# Altium schematic sheet Sheet2.SchDoc: Arduino UNO REV3 Compatible
size A4; Organization: STARLING Electronics; Address2: Belo Horizonte, MG; Address3: Brasil; DocumentNumber: 00.00.01; Revision: 00; SheetNumber: 3; SheetTotal: 3
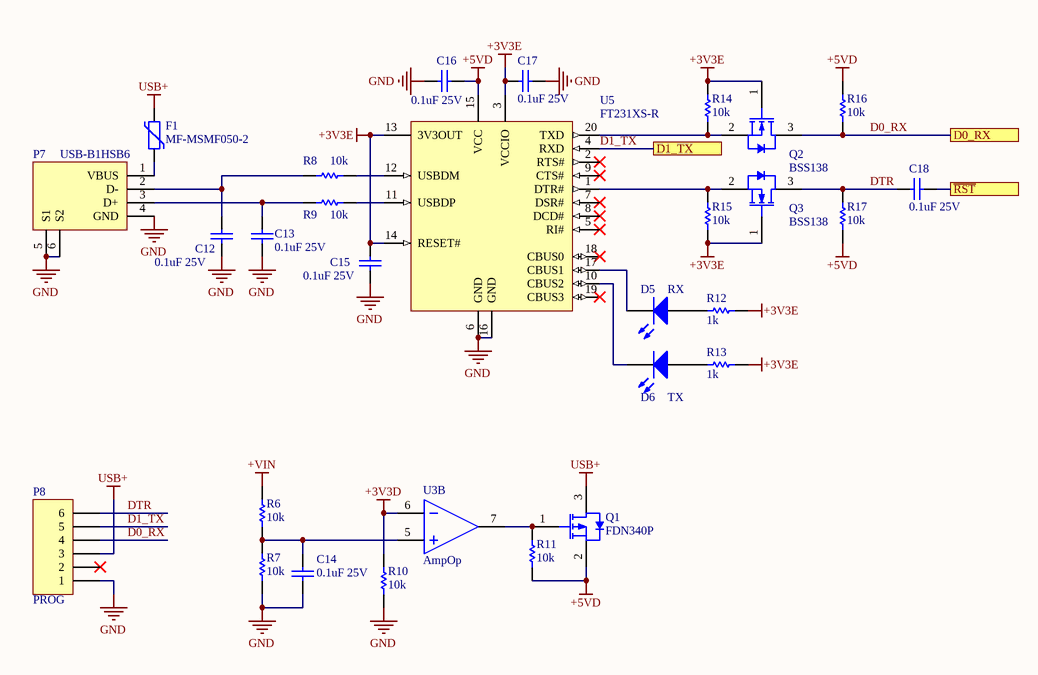
[diagram p0: Sheet2.SchDoc]

## Parts
C12  0.1uF 25V  [C1608[0603]]
C13  0.1uF 25V  [C1608[0603]]
C14  0.1uF 25V  [C1608[0603]]
C15  0.1uF 25V  [C1608[0603]]
C16  0.1uF 25V  [C1608[0603]]
C17  0.1uF 25V  [C1608[0603]]
C18  0.1uF 25V  [C1608[0603]]
D5  RX  [LED-0603-R]
D6  TX  [LED-0603-R]
F1  MF-MSMF050-2  [MF-MSMF050]
P7  USB-B1HSB6  [USB_TYPE_B]
P8  PROG  [HDR1X6m]
Q1  FDN340P  [SOT23]
Q2  BSS138  [SOT23]
Q3  BSS138  [SOT23]
R6  10k  [R1608[0603]]
R7  10k  [R1608[0603]]
R8  10k  [R1608[0603]]
R9  10k  [R1608[0603]]
R10  10k  [R1608[0603]]
R11  10k  [R1608[0603]]
R12  1k  [R1608[0603]]
R13  1k  [R1608[0603]]
R14  10k  [R1608[0603]]
R15  10k  [R1608[0603]]
R16  10k  [R1608[0603]]
R17  10k  [R1608[0603]]
U3  AmpOp  [TSSOP-8]  (part B of 2)
U5  FT231XS-R  [NSSOP-20_N]

## Ports
D0_RX, D1_TX, ~{RST}

## Nets
+3V3D: R10.1 U3.6(IN-)
+3V3E: C15.2 C17.2 Q2.1(GATE) Q3.1(GATE) R12.2 R13.2 R14.1 R15.2 U5.3(VCCIO) U5.13(3V3OUT) U5.14(RESET#)
+5VD: C16.1 Q1.2(SOURCE) R11.2 R16.1 R17.2 U5.15(VCC)
+VIN: R6.1
GND: C12.2 C13.2 C14.1 C15.1 C16.2 C17.1 P7.4(GND) P7.5(S1) P7.6(S2) P8.1 R7.2 R10.2 U5.6(GND) U5.16(GND)
USB+: F1.2 P8.3 Q1.3(DRAIN)
D0_RX: P8.4 Q2.3(DRAIN) R16.2 ; port D0_RX
D1_TX: P8.5 U5.4(RXD) ; port D1_TX
DTR: C18.1 P8.6 Q3.3(DRAIN) R17.1
~{RST}: C18.2 ; port ~{RST}
NetC12_1: C12.1 P7.2(D-) R8.2
NetC13_1: C13.1 P7.3(D+) R9.2
NetC14_2: C14.2 R6.2 R7.1 U3.5(IN+)
NetD5_1: D5.1(A) R12.1
NetD5_2: D5.2(K) U5.17(CBUS1)
NetD6_1: D6.1(A) R13.1
NetD6_2: D6.2(K) U5.10(CBUS2)
NetF1_1: F1.1 P7.1(VBUS)
NetQ1_1: Q1.1(GATE) R11.1 U3.7(OUT)
NetQ2_2: Q2.2(SOURCE) R14.2 U5.20(TXD)
NetQ3_2: Q3.2(SOURCE) R15.1 U5.1(DTR#)
NetR8_1: R8.1 U5.12(USBDM)
NetR9_1: R9.1 U5.11(USBDP)

Not connected (* = marked no-connect by the designer): P8 2*; U5 2(RTS#)* 5(RI#)* 7(DSR#)* 8(DCD#)* 9(CTS#)* 18(CBUS0)* 19(CBUS3)*

## Notes on the sheet
- Title
- Size:
- Date:
- A4
- Number:
- Time:
- Revision:
- Sheet
- of
- File:

## Library data of the parts
C12-C18 = C: Capacitor; Manufacturer Part Number: GCM188R71E104KA57D; Value: 1; Capacitance: 100nF; Tolerance: 10%; Dielectric: X7R; Manufacturer: *; PartNumber: *; Package Type: *; Supplier 1: Digi-Key; Supplier Part Number 1: GCM188R71E104KA57D-ND; Stock 1: 0; Mount: Surface Mount; Case/Package: 0603; Case Code (Imperial): 0603; Case Code (Metric): 1608; Min Operating Temperature: -55°C; Max Operating Temperature: 125°C; Packaging: Tape and Reel; Voltage Rating: 25V; Voltage Rating (DC): 25V; Package Quantity: 4000; Termination: SMD/SMT; Voltage: 25V; Length: 1.6mm; Height: 0.8mm; Width: 0.8mm; Thickness: 0.035inch; Depth: 0.8mm; Ratings: AEC-Q200; Radiation Hardening: No; Lead Free: Lead Free
D5 D6 = LED: Manufacturer Part Number: LTST-C190KSKT; Colour: Yellow; Lens Colour: Clear,Colorless; Forward Voltage: 2.4V; Luminous Intensity: 180mcd; Viewing Angle: 130°; Lens Style: Clear,Colorless,Diffused,Rectangular; Dominant Wavelength: 597nm; Test Current: 20mA; Forward Current: 30mA; Lens Transparency: Clear; Number of Elements: 1; Power Dissipation: 75mW; Wavelength: 588nm; Reverse Voltage: 5V; Manufacturer: *; PartNumber: *; Package Type: *; Supplier 1: Digi-Key; Supplier Part Number 1: 160-1437-1-ND; Stock 1: 422639; Pricing 1: 1=0.29, 10=0.215, 25=0.16, 100=0.1153, 250=0.0798, 500=0.07088, 1000=0.05644 (USD); Mount: Surface Mount; Case/Package: 0603; Number of Pins: 2; Case Code (Metric): 1608; Case Code (Imperial): 0603; Min Operating Temperature: -55°C; Max Operating Temperature: 85°C; Packaging: Tape and Reel; Package Quantity: 1; Illumination Colour: Yellow; Power Rating: 75mW; Number of LEDs: 1; Length: 3.2mm; Height: 0.8mm; Width: 0.8mm; Depth: 1.6mm; Radiation Hardening: No; Lead Free: Lead Free
F1 = MF-MSMF050-2: Resettable Fuse; Max Current Rating: 100A; Power Dissipation: 800mW; Hold Current: 500mA; Trip Current: 1A; Voltage Rating: 15V; Resistance: 150mR; Time to Trip: 0.15s; Approvals: CSA,TUV,UL; Manufacturer: *; PartNumber: *; Package Type: *; Supplier 1: Digi-Key; Supplier Part Number 1: MF-MSMF050-2DKR-ND; Manufacturer Part Number: MF-MSMF050-2; Stock 1: 179041; Pricing 1: 1=0.47, 5=0.456, 10=0.441, 50=0.3712, 100=0.3082, 250=0.2802, 500=0.23816, 1000=0.21014 (USD); Mount: PCB,Surface Mount; Case/Package: 1812; Case Code (Metric): 4532; Case Code (Imperial): 1812; Number of Terminals: 2; Contact Plating: Gold; Terminal Material: Gold; Min Operating Temperature: -40°C; Max Operating Temperature: 85°C; Package Quantity: 2000; Packaging: Tape and Reel; Operating Supply Voltage: 15V; Current Rating: 100A; Termination: SMD/SMT; Voltage Rating (DC): 15V; Length: 4.73mm; Height: 0.85mm; Width: 3.41mm; Radiation Hardening: No; REACH SVHC: No SVHC; Lead Free: Lead Free
P7 = USB type B: Manufacturer: On-Shore Technology; Connector Type: USB; Number of Contacts: 4; Gender: Receptacle; Supplier 1: Digi-Key; Manufacturer Part Number: USB-B1HSB6; Stock 1: 11488; Pricing 1: 1=0.58, 10=0.546, 25=0.4916, 50=0.4368, 100=0.4186, 300=0.3822, 500=0.364, 1000=0.3003, 2500=0.273 (USD); Mount: Through Hole,Horizontal; Package Quantity: 50; Packaging: Tray; ComponentLink1URL: http://www.on-shore.com/wp-content/uploads/2015/09/usb-b1hsxx.pdf?src-supplier=Digi-Key; ComponentLink1Description: http://www.on-shore.com/wp-content/uploads/2015/09/usb-b1hsxx.pdf?src-supplier=Digi-Key; Supplier Part Number 1: ED2983-ND
P8 = Header 6: Header, 6-Pin; Manufacturer: Amphenol FCI; Manufacturer Part Number: 68000-406HLF; Voltage Rating: 1.5kV; Number of Positions: 6; Connector Type: Male Pin; Current Rating: 3A; Gender: Male; Insulation Resistance: 5GR; Pitch: 2.54mm; Mating Post Length: 5.84mm; LatestRevisionDate: 17-Jul-2002; LatestRevisionNote: Re-released for DXP Platform.; Publisher: Altium Limited; Supplier 1: Digi-Key; Supplier Part Number 1: 609-3263-ND; Stock 1: 7266; Pricing 1: 1=0.26, 10=0.245, 100=0.1695, 500=0.14344, 1000=0.11736, 5000=0.10432, 10000=0.09454 (USD); Mount: Through Hole; Contact Plating: Tin; Contact Material: Bronze; Colour: Black; Housing Colour: Black; Housing Material: Thermoplastic; Min Operating Temperature: -65°C; Max Operating Temperature: 125°C; Packaging: Bulk; Number of Rows: 1; Package Quantity: 100; Termination: Solder; Number of Contacts: 6; Max Voltage Rating (AC): 1.5kV; Orientation: Straight; Contact Gender: Male; Length: 15.24mm; Depth: 2.41mm; Termination Post Length: 2.41mm; Contact Mating Length: 0.23inch; Radiation Hardening: No; REACH SVHC: No SVHC; Flammability Rating: UL94 V-0
Q1 = MOSFET-P: P-Channel MOSFET; Element Configuration: Single; Rds On Max: 70mR; Input Capacitance: 779pF; Rise Time: 9ns; Max Power Dissipation: 500mW; Drain to Source Voltage (Vdss): 20V; Continuous Drain Current (ID): 2A; Fall Time: 11ns; Drain to Source Resistance: 60mR; Turn-Off Delay Time: 27ns; Turn-On Delay Time: 10ns; Gate to Source Voltage (Vgs): 8V; Drain to Source Breakdown Voltage: -20V; Current Rating: -2A; Nominal Vgs: -800mV; Number of Elements: 1; Manufacturer: *; PartNumber: *; Package Type: *; Supplier 1: Digi-Key; Supplier Part Number 1: FDN340PDKR-ND; Manufacturer Part Number: FDN340P; Stock 1: 0; Mount: Surface Mount; Case/Package: SOT-23; Number of Pins: 3; Weight: 0.03g; Contact Plating: Matte,Tin; Min Operating Temperature: -55°C; Max Operating Temperature: 150°C; Package Quantity: 1; Packaging: Tape and Reel; Power Dissipation: 500mW; Termination: SMD/SMT; Voltage Rating (DC): -20V; Dual Supply Voltage: -20V; On-State Resistance: 70MR; Threshold Voltage: -800mV; Length: 2.92mm; Height: 0.94mm; Width: 3.05mm; Radiation Hardening: No; REACH SVHC: No SVHC; Lead Free: Lead Free
Q2 Q3 = MOSFET-N: N-Channel MOSFET; Rds On Max: 3.5R; Input Capacitance: 27pF; Nominal Vgs: 1.3V; Number of Elements: 1; Max Power Dissipation: 360mW; Rise Time: 9ns; Dual Supply Voltage: 50V; Continuous Drain Current (ID): 220mA; Turn-Off Delay Time: 20ns; Turn-On Delay Time: 2.5ns; Element Configuration: Single; Gate to Source Voltage (Vgs): 20V; On-State Resistance: 6R; Manufacturer: *; PartNumber: *; Package Type: *; Supplier 1: Digi-Key; Supplier Part Number 1: BSS138CT-ND; Manufacturer Part Number: BSS138; Stock 1: 0; Mount: Surface Mount; Case/Package: SOT-23; Number of Pins: 3; Weight: 0.03g; Contact Plating: Matte,Tin; Min Operating Temperature: -55°C; Max Operating Temperature: 150°C; Packaging: Tape and Reel; Package Quantity: 1; Drain to Source Voltage (Vdss): 50V; Drain to Source Breakdown Voltage: 50V; Fall Time: 9ns; Drain to Source Resistance: 3.5R; Power Dissipation: 360mW; Threshold Voltage: 1.3V; Termination: SMD/SMT; Voltage Rating (DC): 50V; Current Rating: 220mA; Length: 2.92mm; Height: 0.93mm; Width: 1.3mm; Radiation Hardening: No; REACH SVHC: No SVHC; Lead Free: Lead Free
R6-R11 R14-R17 = R: Resistor; Manufacturer Part Number: MCT06030C1002FP500; Value: 0; Resistance: 10kR; Power Rating: 100mW; Tolerance: 1%; Max Power Dissipation: 125mW; Voltage Rating: 75V; Temperature Coefficient: 50ppm/°C; Manufacturer: *; PartNumber: *; Package Type: *; Supplier 1: Digi-Key; Supplier Part Number 1: MCT0603-10.0K-CFDKR-ND; Stock 1: 1373195; Pricing 1: 1=0.18, 10=0.152, 100=0.0596, 1000=0.02495, 2500=0.02287 (USD); Mount: Surface Mount; Case/Package: 0603; Case Code (Imperial): 0603; Case Code (Metric): 1608; Contact Plating: Tin; Min Operating Temperature: -55°C; Max Operating Temperature: 125°C; Packaging: Tape and Reel; Package Quantity: 1; Composition: Thin Film; Military Standard: Not; Voltage Rating (DC): 75V; Number of Terminations: 2; Length: 1.55mm; Height: 0.022inch; Depth: 0.85mm; Width: 0.8mm; Radiation Hardening: No; REACH SVHC: Unknown; Lead Free: Lead Free
R12 R13 = R: Resistor; Manufacturer Part Number: ESR03EZPJ102; Value: 0; Resistance: 1kR; Tolerance: 5%; Temperature Coefficient: 200ppm/°C; Max Power Dissipation: 250mW; Manufacturer: *; PartNumber: *; Package Type: *; Supplier 1: Digi-Key; Supplier Part Number 1: RHM1.0KDDKR-ND; Stock 1: 384185; Pricing 1: 1=0.1, 10=0.087, 100=0.0333, 1000=0.01464, 2500=0.01264 (USD); Case/Package: 0603; Case Code (Metric): 1608; Case Code (Imperial): 0603; Min Operating Temperature: -55°C; Max Operating Temperature: 155°C; Package Quantity: 1; Packaging: Tape and Reel; Composition: Thick Film; Number of Terminations: 2; Features: Automotive AEC-Q200; Length: 0.063inch; Height: 0.022inch; Width: 0.031inch; Lead Free: Lead Free
U3 = LM358PWR: Manufacturer: Texas Instruments; Number of Channels: 2; Gain Bandwidth Product: 700kHz; Slew Rate: 0.3V/µs; Output Current: 30mA; Nominal Supply Current: 1.2mA; Input Bias Current: 250nA; Input Offset Voltage (Vos): 7mV; Operating Supply Current: 1mA; Min Supply Voltage: 3V; Max Supply Voltage: 32V; Voltage Gain: 100dB; Common Mode Rejection Ratio: 65dB; Min Dual Supply Voltage: 1.5V; Max Dual Supply Voltage: 16V; Quiescent Current: 600mA; Supplier 1: Mouser; Manufacturer Part Number: LM358PWR; Stock 1: 6529; Pricing 1: 1=0.38, 10=0.284, 50=0.284, 100=0.154, 1000=0.116, 2000=0.1, 10000=0.093, 24000=0.086, 50000=0.082, 100000=0.079 (USD); Mount: Surface Mount; Case/Package: TSSOP; Number of Pins: 8; Min Operating Temperature: 0°C; Max Operating Temperature: 70°C; Packaging: Tape and Reel; Number of Circuits: 2; Output Current per Channel: 30mA; Package Quantity: 1; Bandwidth: 700kHz; Unity Gain Bandwidth Product: 700kHz; Number of Elements: 2; Operating Supply Voltage: 16V; Number of Amplifiers: 2; Radiation Hardening: No; Lead Free: Lead Free; REACH SVHC: No SVHC; ComponentLink1URL: http://www.ti.com/general/docs/suppproductinfo.tsp?distId=10&amp;gotoUrl=http%3A%2F%2Fwww.ti.com%2Flit%2Fgpn%2Flm358&src-supplier=Digi-Key; ComponentLink1Description: http://www.ti.com/general/docs/suppproductinfo.tsp?distId=10&amp;gotoUrl=http%3A%2F%2Fwww.ti.com%2Flit%2Fgpn%2Flm358&src-supplier=Digi-Key; ComponentLink2URL: http://www.ti.com/lit/ds/symlink/lm358.pdf?src-supplier=Digi-Key; ComponentLink2Description: http://www.ti.com/lit/ds/symlink/lm358.pdf?src-supplier=Digi-Key; ComponentLink3URL: http://www.produktinfo.conrad.com/datenblaetter/1000000-1099999/001072378-da-01-en-IC_OPAMP_GP_700KHZ_LM358PWR_TSSOP_8_TID.pdf?src-supplier=Conrad; ComponentLink3Description: http://www.produktinfo.conrad.com/datenblaetter/1000000-1099999/001072378-da-01-en-IC_OPAMP_GP_700KHZ_LM358PWR_TSSOP_8_TID.pdf?src-supplier=Conrad; Supplier Part Number 1: 595-LM358PWR
U5 = FT231XS-R: USB to Full-Handshake UART Interface Chip, UHCI/OHCI/EHCI Compatible, USB 2.0 Compatible, -40 to +85 degC, 20-Pin SSOP, Pb-Free, Tape and Reel; Manufacturer: FTDI; Max Supply Voltage: 5.5V; Min Supply Voltage: 2.97V; Number of Channels: 1; Operating Supply Voltage: 5V; Data Rate: 12Mbps; Interface: UART,USB; Operating Supply Current: 8mA; DatasheetVersion: ver 1.2, Feb-2013; PackageVersion: Feb-13; PackageReference: SSOP-20; PackageDescription: 20-Pin Small Outline Package, 8.6 x 3.9 mm Body, 0.635 mm Pitch; Code_JEDEC: MO-137-AD; PartNumber: FT231XS-R; ComponentLink1Description: Manufacturer URL; ComponentLink1URL: http://www.ftdichip.com/; ComponentLink2Description: Datasheet; ComponentLink2URL: http://www.ftdichip.com/Support/Documents/DataSheets/ICs/DS_FT231X.pdf; ComponentLink3Description: FT231X Product Page; ComponentLink3URL: www.ftdichip.com/Products/ICs/FT231X.html; Mount: Surface Mount; Case/Package: SSOP; Number of Pins: 20; Weight: 0.016oz; Min Operating Temperature: -40°C; Max Operating Temperature: 85°C; Packaging: Tape and Reel; Package Quantity: 2000; Length: 8.74mm; Height: 0.059inch; Width: 0.157inch; Radiation Hardening: No; ComponentLink4URL: http://uk.rs-online.com/webdocs/1102/0900766b811020d3.pdf; ComponentLink4Description: http://uk.rs-online.com/webdocs/1102/0900766b811020d3.pdf; ComponentLink5URL: https://media.digikey.com/pdf/Data%20Sheets/FTDI%20Chip%20PDFs/X-Chip_Series_Errata.pdf; ComponentLink5Description: https://media.digikey.com/pdf/Data%20Sheets/FTDI%20Chip%20PDFs/X-Chip_Series_Errata.pdf; ComponentLink6URL: http://www.alliedelec.com/images/products/datasheets/bm/FTDI/70403932.pdf; ComponentLink6Description: http://www.alliedelec.com/images/products/datasheets/bm/FTDI/70403932.pdf; Manufacturer Part Number: FT231XS-R; Pricing 1: 1=2.12, 25=2.05, 100=1.98, 250=1.78, 500=1.60002 (USD); Stock 1: 8392; Supplier 1: Digi-Key; Supplier Part Number 1: 768-1129-6-ND